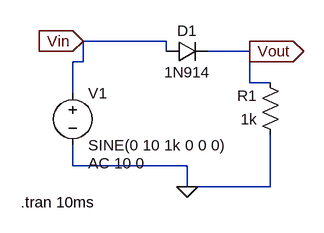
[diagram p0: schematic diode.asc]
diode.asc, the LTspice schematic file:
Version 4
SHEET 1 880 680
WIRE 64 32 -64 32
WIRE 64 48 64 32
WIRE 192 48 128 48
WIRE -64 64 -64 32
WIRE -64 64 -80 64
WIRE 192 96 192 48
WIRE 224 96 192 96
WIRE -80 112 -80 64
WIRE -80 224 -80 192
WIRE 96 224 -80 224
WIRE 96 256 96 224
WIRE 224 256 224 176
WIRE 224 256 96 256
FLAG 96 256 0
FLAG -64 32 Vin
IOPIN -64 32 In
FLAG 192 48 Vout
IOPIN 192 48 Out
SYMBOL diode 64 64 R270
WINDOW 0 32 32 VTop 2
WINDOW 3 0 32 VBottom 2
SYMATTR InstName D1
SYMATTR Value 1N914
SYMBOL res 240 192 R180
WINDOW 0 36 76 Left 2
WINDOW 3 36 40 Left 2
SYMATTR InstName R1
SYMATTR Value 1k
SYMBOL voltage -80 96 R0
WINDOW 123 24 124 Left 2
WINDOW 39 0 0 Left 0
SYMATTR Value2 AC 10 0
SYMATTR InstName V1
SYMATTR Value SINE(0 10 1k 0 0 0)
TEXT -160 280 Left 2 !.tran 10ms

The netlist it stands for:
* diode.asc
D1 Vin Vout 1N914
R1 0 Vout 1k
V1 Vin 0 SINE(0 10 1k 0 0 0) AC 10 0
.model D D
.lib standard.dio
.tran 10ms
.backanno
.end